# EAGLE design comparator (EAGLE 7.1.0)
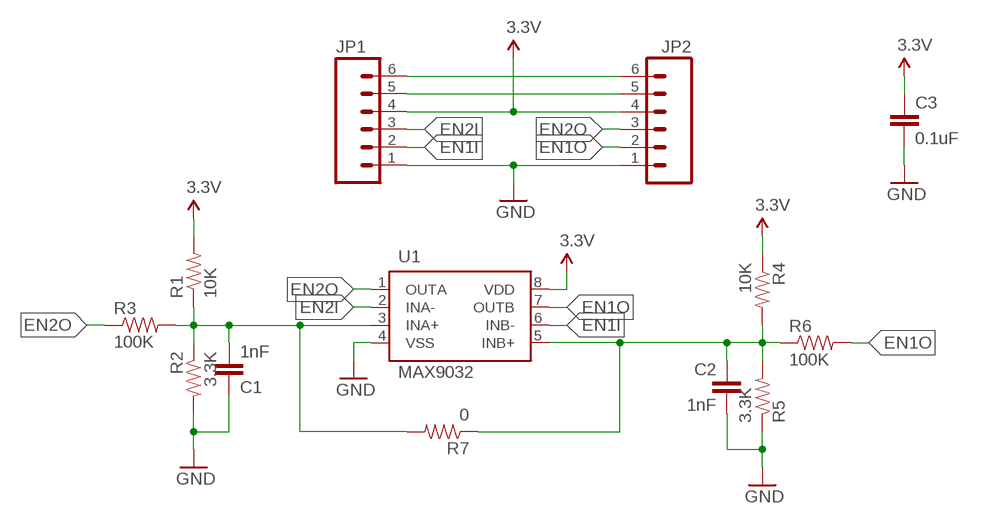
[diagram p0: schematic, sheet 1]

## Parts
C1  1nF  CAP0603-CAP  [0603-CAP]
C2  1nF  CAP0603-CAP  [0603-CAP]
C3  0.1uF  CAP0603-CAP  [0603-CAP]
JP1  M06SMDF  [1X06-SMD-FEMALE]
JP2  M06LOCK  [1X06_LOCK]
R1  10K  RESISTOR0603  [0603-RES]
R2  3.3K  RESISTOR0603  [0603-RES]
R3  100K  RESISTOR0603  [0603-RES]
R4  10K  RESISTOR0603  [0603-RES]
R5  3.3K  RESISTOR0603  [0603-RES]
R6  100K  RESISTOR0603  [0603-RES]
R7  0  RESISTOR0603  [0603-RES]
U1  MAX9032  [SOT23-8]

## Nets
3.3V: C3.1 JP1.4 JP2.4 R1.2 R4.1 U1.8(VDD)
EN1I: JP1.2 U1.6(INB-)
EN1O: JP2.2 R6.2 U1.7(OUTB)
EN2I: JP1.3 U1.2(INA-)
EN2O: JP2.3 R3.1 U1.1(OUTA)
GND: C1.1 C2.2 C3.2 JP1.1 JP2.1 R2.2 R5.1 U1.4(VSS)
N$1: JP1.6 JP2.6
N$2: JP1.5 JP2.5
N$3: C1.2 R1.1 R2.1 R3.2 R7.2 U1.3(INA+)
N$6: C2.1 R4.2 R5.2 R6.1 R7.1 U1.5(INB+)

## Library data of the parts
C1-C3 = SparkFun-Capacitors:CAP: Capacitor Standard 0603 ceramic capacitor, and 0.1" leaded capacitor.
JP1 JP2 = SparkFun-Connectors:M06: Header 6 Standard 6-pin 0.1" header. Use with straight break away headers (SKU : PRT-00116), right angle break away headers (PRT-00553), swiss pins (PRT-00743), machine pins (PRT-00117), and female headers (PRT-00115). Molex polarized connector foot print use with SKU : PRT-08094 with associated crimp pins and housings. NOTES ON THE VARIANTS LOCK and LOCK_LONGPADS... This footprint was designed to help hold the alignment of a through-hole component (i.e. 6-pin header) while soldering it into place. You may notice that each hole has been shifted either up or down by 0.005 of an inch from it's more standard position (which is a perfectly straight line). This slight alteration caused the pins (the squares in the middle) to touch the edges of the holes. Because they are alternating, it causes a "brace" to hold the component in place. 0.005 has proven to be the perfect amount of "off-center" position when using our standard breakaway headers. Although looks a little odd when you look at the bare footprint, once you have a header in there, the alteration is very hard to notice. Also,if you push a header all the way into place, it is covered up entirely on the bottom side. This idea of altering the position of holes to aid alignment will be further integrated into the Sparkfun Library for other footprints. It can help hold any component with 3 or more connection pins.
R1-R7 = SparkFun-Resistors:RESISTOR: Resistor Basic schematic elements and footprints for 0603, 1206, and PTH resistors.
U1 = Custom:MAX9032

## Board
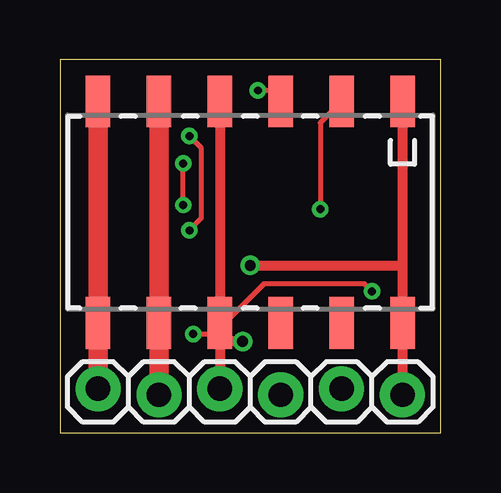
[diagram p1: board, top side]
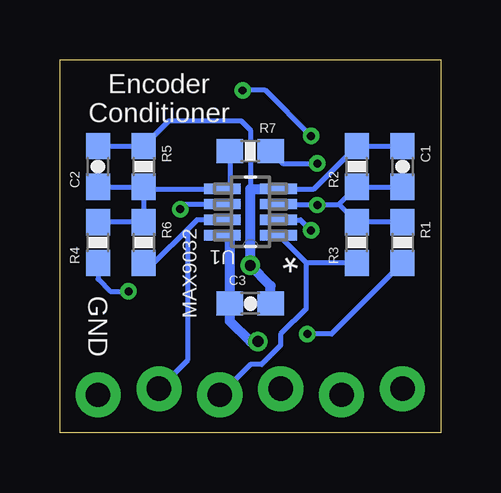
[diagram p2: board, bottom side, seen from below]

Size 15.88 x 15.56 mm. Coordinates in mm from the lower left corner, seen from the top.
Outline: 0,0 15.88,0 15.88,15.56 0,15.56 0,0
Copper layers (1*16): Top 0.0356mm / dielectric 1.5011mm / Bottom 0.0356mm
Design rules "LaenPCBOrder": minimum track width 6mil, minimum drill 13mil, track to track 6mil, track to pad 6mil, pad to pad 6mil, via to via 6mil, smd to smd 6mil, copper to edge 15mil, drill to drill 6mil, minimum pad ring 7mil, minimum via ring 7mil, stop-mask expansion 3mil, vias tented up to drill 0mil, thermal gap 10mil

### Footprints (pad centres in the part's own frame; a part is rotated, then mirrored left to right if it is on the bottom)
0603-CAP = smd 1.1 x 1: 1 -0.85,0; 2 0.85,0
1X06-SMD-FEMALE = smd 1.02 x 2.16: 1 -6.35,-4.62; 2 -3.81,-4.62; 3 -1.27,-4.62; 4 1.27,-4.62; 5 3.81,-4.62; 6 6.35,-4.62; A1 -6.35,4.62; A2 -3.81,4.62; A3 -1.27,4.62; A4 1.27,4.62; A5 3.81,4.62; A6 6.35,4.62
1X06_LOCK = drill 1.016 pad 1.88: 1 0,0; 2 2.54,-0.254; 3 5.08,0; 4 7.62,-0.254; 5 10.16,0; 6 12.7,-0.254
0603-RES = smd 1.1 x 1: 1 -0.85,0; 2 0.85,0
SOT23-8 = smd 1.524 x 0.432: 1 -1.176,0.958; 2 -1.176,0.323; 3 -1.176,-0.337; 4 -1.176,-0.972; 5 1.161,-0.972; 6 1.161,-0.337; 7 1.161,0.323; 8 1.161,0.958

### Placement (x,y rotation side)
C1  1.59,11.11 270 bottom
C2  14.29,11.11 90 bottom
C3  7.94,5.4 0 bottom
JP1  7.94,9.21 180 top
JP2  14.29,1.59 180 top
R1  1.59,7.94 270 bottom
R2  3.49,11.11 90 bottom
R3  3.49,7.94 90 bottom
R4  14.29,7.94 90 bottom
R5  12.38,11.11 270 bottom
R6  12.38,7.94 270 bottom
R7  7.94,11.75 0 bottom
U1  7.94,9.21 180 bottom

### Tracks (layer width: path | path; a pad name or v marks a point on that pad's centre or on a via)
3.3V  (via drill 0.33, 0.46)
  Top 0.203: v5.56,4.13 6.67,4.13 | v13.02,5.91 12.7,6.22 8.51,6.22 6.73,4.45 6.73,4.13
  Top 0.406: JP1.4 6.67,4.13 | 6.67,4.13 JP2.4 | 6.67,4.13 6.73,4.13 7.05,3.81 v7.62,3.81
  Bottom 0.203: R1.2 4.55,4.13 v5.56,4.13 | R4.1 14.29,6.41 13.78,5.91 v13.02,5.91
  Bottom 0.406: C3.1 8.79,8.25 U1.8 | 8.89,5.08 8.89,5.29 C3.1 | v7.62,3.81 7.94,3.81 8.79,4.66 C3.1
EN1I  (via drill 0.33)
  Top 0.203: 11.75,14.29 JP1.2 10.86,12.94 v10.86,9.34
  Bottom 0.203: v10.86,9.34 10.65,9.54 U1.6
EN1O
  Bottom 0.203: U1.7 10.17,8.88 10.54,8.51 | 10.54,8.51 11.96,7.09 R6.2 | JP2.2 10.54,3.05 10.54,8.51
EN2I  (via drill 0.33)
  Top 0.203: v5.4,8.45 5.91,8.95 5.91,11.87 v5.4,12.38 | v8.26,14.29 9.21,14.29 JP1.3
  Bottom 0.203: U1.2 5.84,8.88 v5.4,8.45 | v5.4,12.38 7.3,14.29 v8.26,14.29
EN2O
  Bottom 0.203: R3.1 5.6,7.09 | 5.6,7.09 U1.1 | 5.6,7.09 5.6,5.2 6.67,4.13 6.67,3.65 7.46,2.86 7.94,2.86 JP2.3
GND  (via drill 0.46)
  Top 0.406: JP1.1 14.29,6.99 | 14.29,6.99 JP2.1 | v7.94,6.99 14.29,6.99
  Bottom 0.203: U1.4 5.28,10.18 R2.2 C1.1 | 7.94,10.18 7.94,12.64 8.32,13.02 11.33,13.02 R5.1 C2.2
  Bottom 0.406: U1.4 7.94,10.18 v7.94,6.99 7.09,6.13 C3.2
N$1
  Top 0.813: JP1.6 JP2.6
N$2
  Top 0.813: JP1.5 JP2.5
N$3  (via drill 0.33)
  Top 0.203: v5.14,9.51 v5.14,11.24
  Bottom 0.203: R1.1 R3.2 4.21,9.51 | C1.2 R2.1 4.21,9.54 4.21,9.51 | 4.21,9.51 v5.14,9.51 6.76,9.51 U1.3 | R7.2 6.58,11.24 v5.14,11.24
N$6
  Bottom 0.203: R5.2 R6.1 R4.2 | C2.1 R5.2 | R5.2 12.3,10.18 U1.5 8.79,10.18 R7.1

### Text on the board
bPlace: Encoder / Conditioner | MAX9032 | GND